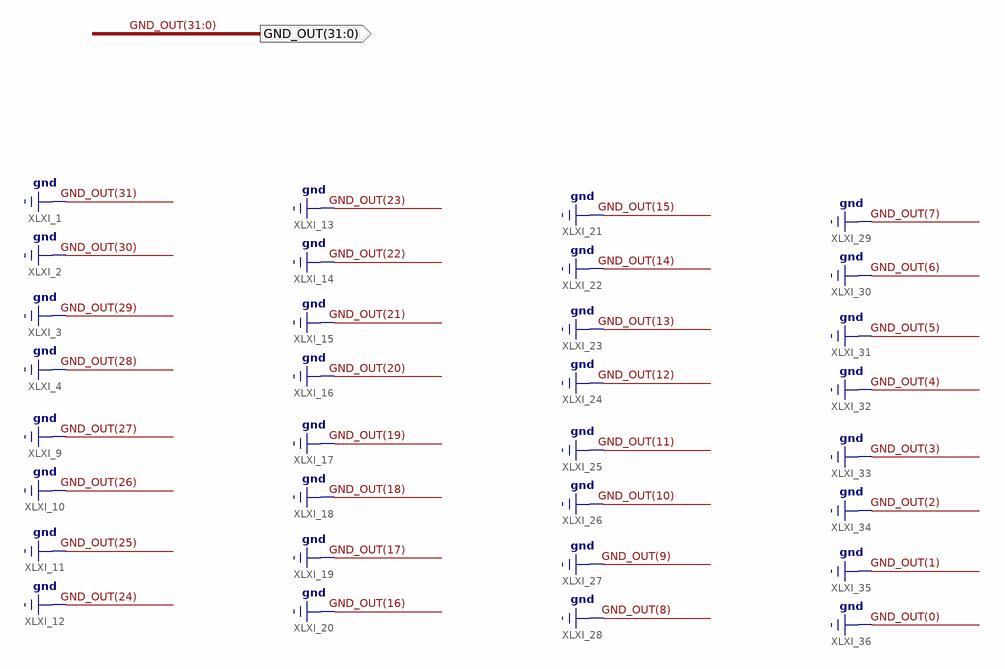
[diagram p0: schematic sheet 1]
// Xilinx ISE schematic GND_32.sch (artix7) as structural Verilog: 0 symbols, 1 ports
module GND_32 (
  output [31:0] GND_OUT
);


  assign GND_OUT = {32{1'b0}};
endmodule
